# Altium schematic sheet [1] PowerSupply.SchDoc
size A4; Organization: UNMEI ELECTRICAL; Address1: 16B/12 Nguyen Du Street; Address2: Da Lat City, LD Province; SheetNumber: 1; SheetTotal: 7
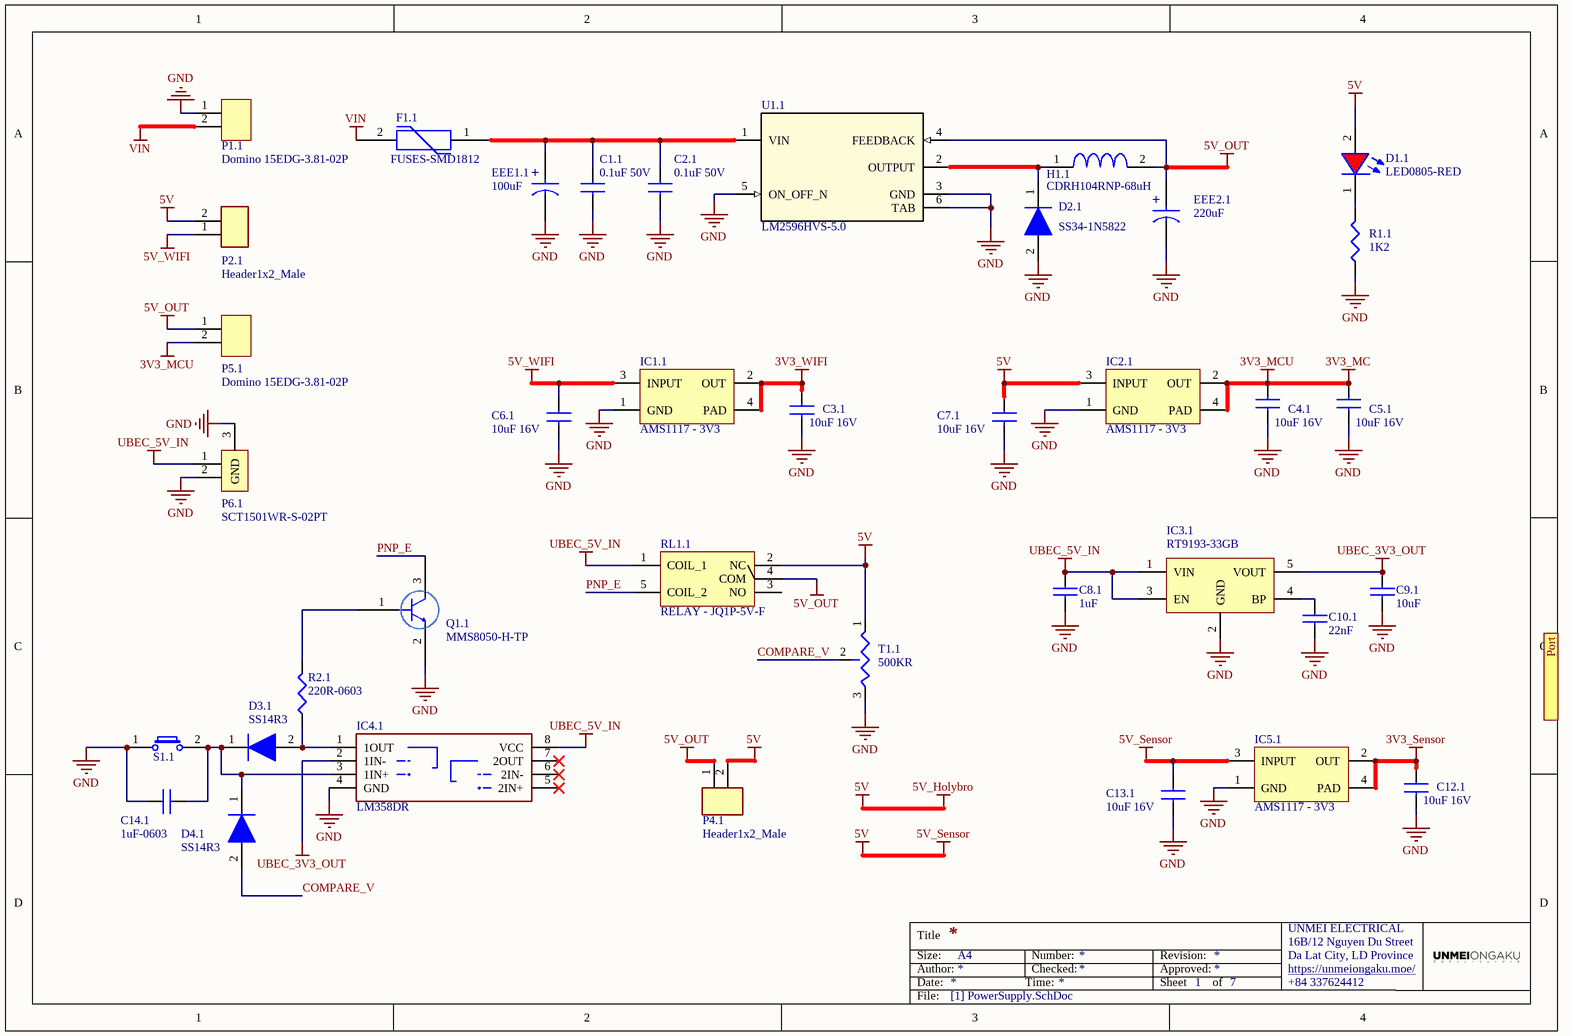
[diagram p0: [1] PowerSupply.SchDoc]

## Parts
C1.1  0.1uF 50V  [CAP0805]
C2.1  0.1uF 50V  [CAP0805]
C3.1  10uF 16V  [CAP0805]
C4.1  10uF 16V  [CAP0805]
C5.1  10uF 16V  [CAP0805]
C6.1  10uF 16V  [CAP0805]
C7.1  10uF 16V  [CAP0805]
C8.1  1uF  [CAP0603]
C9.1  10uF  [CAP0603]
C10.1  22nF  [CAP0603]
C12.1  10uF 16V  [CAP0805]
C13.1  10uF 16V  [CAP0805]
C14.1  1uF-0603  [CAP0603]
D1.1  LED0805-RED  [LED0805-RED]
D2.1  SS34-1N5822  [SS34 - 1N5822 / DO-214AA, SMA]
D3.1  SS14R3  [SS14 - 1N5819 / DO-214AA, SMA]
D4.1  SS14R3  [SS14 - 1N5819 / DO-214AA, SMA]
EEE1.1  100uF  [CAPACITOR/ALU - SIZE D8/SMD - 6.3X7.7]
EEE2.1  220uF  [CAPACITOR/ALU - SIZE D8/SMD - 6.3X7.7]
F1.1  FUSES-SMD1812  [FUSES - SMD1812]
H1.1  CDRH104RNP-68uH  [CDRH104RNP]
IC1.1  AMS1117 - 3V3  [SOT223-4M_AMS1117_3V3]
IC2.1  AMS1117 - 3V3  [SOT223-4M_AMS1117_3V3]
IC3.1  RT9193-33GB  [SOT23-5]
IC4.1  LM358DR  [SOP8]
IC5.1  AMS1117 - 3V3  [SOT223-4M_AMS1117_3V3]
P1.1  Domino 15EDG-3.81-02P  [Domino 15EDG3.81 2P]
P2.1  Header1x2_Male  [HDR1x2_2.54_MALE]
P4.1  Header1x2_Male  [HDR1x2_2.54_MALE]
P5.1  Domino 15EDG-3.81-02P  [Domino 15EDG3.81 2P]
P6.1  SCT1501WR-S-02PT  [Connector ZH1.5 2P SMD]
Q1.1  MMS8050-H-TP  [SOT23]
R1.1  1K2  [RES0805]
R2.1  220R-0603  [RES0603 - 3D]
RL1.1  RELAY - JQ1P-5V-F  [RELAY - JQ1P - XV - F 10A SPDT]
S1.1  434121043816  [Switches-6x3.5x4.3mm]  (value not drawn)
T1.1  500KR  [Rheostat - 3296W]
U1.1  LM2596HVS-5.0  [TO265-5]

## Ports
Port

## Nets
3V3_MC: C4.1.1 C5.1.1 IC2.1.2(OUT) IC2.1.4(PAD) P5.1.2  [also labelled 3V3_MCU]
3V3_Sensor: C12.1.1 IC5.1.2(OUT) IC5.1.4(PAD)
3V3_WIFI: C3.1.1 IC1.1.2(OUT) IC1.1.4(PAD)
5V: C7.1.1 C13.1.1 D1.1.2(+) IC2.1.3(INPUT) IC5.1.3(INPUT) P2.1.2 P4.1.2 RL1.1.2(NC) T1.1.1  [also labelled 5V_Holybro, 5V_Sensor]
5V_OUT: EEE2.1.1 H1.1.2 P4.1.1 P5.1.1 RL1.1.4(COM) U1.1.4(FEEDBACK)
5V_WIFI: C6.1.1 IC1.1.3(INPUT) P2.1.1
GND: C1.1.2 C2.1.2 C3.1.2 C4.1.2 C5.1.2 C6.1.2 C7.1.2 C8.1.2 C9.1.2 C10.1.2 C12.1.2 C13.1.2 C14.1.1 D2.1.2 EEE1.1.2 EEE2.1.2 IC1.1.1(GND) IC2.1.1(GND) IC3.1.2(GND) IC4.1.4(GND) IC5.1.1(GND) P1.1.1 P6.1.2 P6.1.3(GND) Q1.1.2 R1.1.1 S1.1.1 T1.1.3 U1.1.3(GND) U1.1.5(ON_OFF_N) U1.1.6(TAB)
UBEC_3V3_OUT: C9.1.1 IC3.1.5(VOUT) IC4.1.2(1IN-)
UBEC_5V_IN: C8.1.1 IC3.1.1(VIN) IC3.1.3(EN) IC4.1.8(VCC) P6.1.1 RL1.1.1(COIL_1)
VIN: F1.1.2 P1.1.2
COMPARE_V: D4.1.2 T1.1.2
PNP_E: Q1.1.3 RL1.1.5(COIL_2)
NetC1.1_1: C1.1.1 C2.1.1 EEE1.1.1 F1.1.1 U1.1.1(VIN)
NetC10.1_1: C10.1.1 IC3.1.4(BP)
NetC14.1_2: C14.1.2 D3.1.1 D4.1.1 IC4.1.3(1IN+) S1.1.2
NetD1.1_1: D1.1.1(+) R1.1.2
NetD2.1_1: D2.1.1 H1.1.1 U1.1.2(OUTPUT)
NetD3.1_2: D3.1.2 IC4.1.1(1OUT) R2.1.1
NetQ1.1_1: Q1.1.1 R2.1.2

Not connected (* = marked no-connect by the designer): IC4.1 5(2IN+)* 6(2IN-)* 7(2OUT)*; RL1.1 3(NO)

## Notes on the sheet
- Title
- Size:
- Date:
- Author:
- A4
- Time:
- Number:
- Checked:
- Revision:
- Sheet
- Approved:
- of
- https://unmeiongaku.moe/
- +84 337624412
- File:
- (in symbol EEE-1EA101XP) +

## Library data of the parts
C1.1 C2.1 = C0805C104K5RACTU: Cap Ceramic 0.1uF 50V X7R 10% SMD 2.0 x 1.2 mm 125 C Paper T/R; Manufacturer: KEMET; Capacitance: 100nF; Voltage: 500V; Supplier 1: RSComponents; Manufacturer Part Number: C0805C104K5RACTU; RoHS: Yes; Category: Ceramic Capacitors; Stock 1: 45175; Pricing 1: 25=0.20300, 100=0.18800, 250=0.17500, 500=0.16400, 1250=0.15100 (USD); Mount: Surface Mount,PCB; Case/Package: 0805; Number of Pins: 2; Dielectric Material: Ceramic; Case Code (Imperial): 0805; Case Code (Metric): 2012; Contact Plating: Tin,Matte; Min Operating Temperature: -55°C; Max Operating Temperature: 125°C; Tolerance: 10%; Packaging: Tape and Reel; Dielectric: X7R; Voltage Rating (DC): 50V; Package Quantity: 4000; Voltage Rating: 50V; Termination: SMD/SMT; Series: C0805C; Construction: Flat; Length: 2mm; Width: 1.2mm; Height: 0.9mm; Depth: 1.25mm; Lead Pitch: 0.75mm; Thickness: 0.035inch; Radiation Hardening: No; RoHS Compliant: Yes; REACH SVHC: No SVHC; ComponentLink1URL: https://datasheet.ciiva.com/32431/slceramic-chip-condensers-e-32431755.pdf?src-supplier=Distrelec; ComponentLink1Description: https://datasheet.ciiva.com/32431/slceramic-chip-condensers-e-32431755.pdf?src-supplier=Distrelec; ComponentLink2URL: https://datasheet.ciiva.com/28682/1851736-28682232.pdf?src-supplier=Element14; ComponentLink2Description: https://datasheet.ciiva.com/28682/1851736-28682232.pdf?src-supplier=Element14; ComponentLink3URL: https://datasheet.ciiva.com/18410/70095383-18410815.pdf?src-supplier=Allied+Electronics; ComponentLink3Description: https://datasheet.ciiva.com/18410/70095383-18410815.pdf?src-supplier=Allied+Electronics; ComponentLink4URL: https://datasheet.ciiva.com/14589/70095383-14589048.pdf?src-supplier=Allied+Electronics; ComponentLink4Description: https://datasheet.ciiva.com/14589/70095383-14589048.pdf?src-supplier=Allied+Electronics; Supplier Part Number 1: 2644416
C3.1 C4.1 C5.1 C6.1 C7.1 C12.1 C13.1 = C0805C106K4PACTU: Ceramic Capacitors MLCC - SMD/SMT 16V 10uF X5R 0805 10%; Manufacturer: KEMET; Dissipation Factor: 5%; Supplier 1: RSComponents; Manufacturer Part Number: C0805C106K4PACTU; RoHS: Yes; Category: Ceramic Capacitors; Stock 1: 60; Pricing 1: 10=1.00600, 50=0.94500, 100=0.88500, 250=0.82400, 500=0.75400 (USD); Mount: Surface Mount; Case/Package: 0805; Number of Pins: 2; Dielectric Material: Ceramic; Case Code (Imperial): 0805; Case Code (Metric): 2012; Contact Plating: Tin,Matte; Min Operating Temperature: -55°C; Max Operating Temperature: 85°C; Capacitance: 10uF; Tolerance: 10%; Dielectric: X5R; Voltage Rating (DC): 16V; Packaging: Tape and Reel; Voltage: 16V; Termination: SMD/SMT; Package Quantity: 1; Voltage Rating: 16V; Series: C; Construction: Flat; Length: 2mm; Width: 0.049inch; Height: 1.25mm; Depth: 1.25mm; Thickness: 0.055inch; Radiation Hardening: No; Lead Free: Lead Free; RoHS Compliant: Yes; REACH SVHC: No SVHC; ComponentLink1URL: https://datasheet.ciiva.com/7842/1732713-7842196.pdf?src-supplier=Element14; ComponentLink1Description: https://datasheet.ciiva.com/7842/1732713-7842196.pdf?src-supplier=Element14; ComponentLink2URL: https://datasheet.ciiva.com/28682/1831760-28682305.pdf?src-supplier=Element14; ComponentLink2Description: https://datasheet.ciiva.com/28682/1831760-28682305.pdf?src-supplier=Element14; ComponentLink3URL: https://datasheet.ciiva.com/11787/0900766b8116eb59-11787314.pdf?src-supplier=RSComponents; ComponentLink3Description: https://datasheet.ciiva.com/11787/0900766b8116eb59-11787314.pdf?src-supplier=RSComponents; ComponentLink4URL: https://datasheet.ciiva.com/7842/1732713-7842197.pdf?src-supplier=Element14; ComponentLink4Description: https://datasheet.ciiva.com/7842/1732713-7842197.pdf?src-supplier=Element14; ComponentLink5URL: https://datasheet.ciiva.com/26847/getdatasheetpartid-110990-26847815.pdf?src-supplier=Verical; ComponentLink5Description: https://datasheet.ciiva.com/26847/getdatasheetpartid-110990-26847815.pdf?src-supplier=Verical; Supplier Part Number 1: 6911161
C8.1 C14.1 = CC0603KRX7R7BB105: CAP CER 1UF 16V X7R 0603; Manufacturer 1: Yageo; Category 1: Capacitors; Capacitance: 1µF; Tolerance: ±10%; Supplier 1: Digi-Key; Supplier Part Number 1: 311-1446-1-ND; Manufacturer Part Number 1: CC0603KRX7R7BB105; RoHS 1: RoHS Compliant; Description 1: CAP CER 1UF 16V X7R 0603; Stock 1: 274580; Pricing 1: 1=0.1, 10=0.051, 100=0.0227, 500=0.0162, 1000=0.01274 (USD); Packaging: Cut Tape (CT); Part Status: Active; Voltage - Rated: 16V; Temperature Coefficient: X7R; Operating Temperature: -55°C ~ 125°C; Features: -; Ratings: -; Applications: General Purpose; Failure Rate: -; Mounting Type: Surface Mount, MLCC; Package / Case: 0603 (1608 Metric); Size / Dimension: 0.063" L x 0.031" W (1.60mm x 0.80mm); Height - Seated (Max): -; Thickness (Max): 0.035" (0.90mm); Lead Spacing: -; Lead Style: -; ComponentLink1URL: http://www.yageo.com/documents/recent/UPY-GPHC_X7R_6.3V-to-50V_18.pdf; ComponentLink1Description: http://www.yageo.com/documents/recent/UPY-GPHC_X7R_6.3V-to-50V_18.pdf; Value: 1uF
C9.1 = CC0603KRX5R6BB106: CAP CER 10UF 10V X5R 0603; Manufacturer 1: Yageo; Category 1: Capacitors; Capacitance: 10µF; Tolerance: ±10%; Supplier 1: Digi-Key; Supplier Part Number 1: 311-1782-1-ND; Manufacturer Part Number 1: CC0603KRX5R6BB106; RoHS 1: RoHS Compliant; Description 1: CAP CER 10UF 10V X5R 0603; Stock 1: 66566; Pricing 1: 1=0.33, 10=0.225, 100=0.1272, 500=0.08982, 1000=0.07858 (USD); Packaging: Cut Tape (CT); Part Status: Active; Voltage - Rated: 10V; Temperature Coefficient: X5R; Operating Temperature: -55°C ~ 85°C; Features: -; Ratings: -; Applications: General Purpose; Failure Rate: -; Mounting Type: Surface Mount, MLCC; Package / Case: 0603 (1608 Metric); Size / Dimension: 0.063" L x 0.031" W (1.60mm x 0.80mm); Height - Seated (Max): -; Thickness (Max): 0.035" (0.90mm); Lead Spacing: -; Lead Style: -; ComponentLink1URL: http://www.yageo.com/documents/recent/UPY-GPHC_X5R_4V-to-50V_24.pdf; ComponentLink1Description: http://www.yageo.com/documents/recent/UPY-GPHC_X5R_4V-to-50V_24.pdf; Value: 10uF
C10.1 = CC0603KRX7R9BB223: Multilayer Ceramic Capacitors MLCC - SMD/SMT 22nF 50V X7R 10%; Manufacturer: Yageo; Capacitance: 0.022 uF; Type: General Purpose and High Capacitance Surface Mount Ceramic Multilayer Capacitor; Voltage Rating DC: 50 VDC; Capacitance - pF: 22000 pF; Class: Class 2; Supplier 1: Mouser; Manufacturer Part Number: CC0603KRX7R9BB223; RoHS: RoHS Compliant; Category: Multilayer Ceramic Capacitors MLCC - SMD/SMT; Stock 1: 23033; Pricing 1: 1=0.100, 10=0.064, 100=0.020, 1000=0.015, 4000=0.011, 8000=0.010, 24000=0.009 (USD); Height: 0.8 mm; Length: 1.6 mm; Package / Case: 0603 (1608 metric); Packaging: Cut Tape; Product: General Type MLCCs; Series: CC; Termination Style: SMD/SMT; Tolerance: 10 %; Width: 0.8 mm; Brand: Yageo; Capacitance - nF: 22 nF; Case Code - in: 0603; Case Code - mm: 1608; Dielectric: X7R; Maximum Operating Temperature: + 125 C; Minimum Operating Temperature: - 55 C; Product Type: Ceramic Capacitors; Standard Pack Qty: 4000; Subcategory: Capacitors; Termination: Standard; RoHS - Mouser: Y; Minimum Order Quantity: 1; Reeling: True; ComponentLink1URL: https://www.mouser.com/datasheet/2/447/UPY-GPHC_X7R_6.3V-to-50V_18-1154002.pdf; ComponentLink1Description: https://www.mouser.com/datasheet/2/447/UPY-GPHC_X7R_6.3V-to-50V_18-1154002.pdf; Supplier Part Number 1: 603-CC603KRX7R9BB223; Value: 22nF
D2.1 = SS34: SS Series 500 mV 3 A 40 V Max Reverse Voltage Schottky Rectifier - DO-214AB; Manufacturer: ON Semiconductor / Fairchild; Number of Terminals/Pins: 2; Package Body Material: Plastic; Diode Element Material: SILICON; Forward Current: 3A; Element Configuration: Single; Max Repetitive Reverse Voltage (Vrrm): 40V; Forward Voltage: 500mV; Max Forward Surge Current (Ifsm): 100A; Polarity: Standard; Max Reverse Current: 500uA; Number of Elements: 1; Max Power Dissipation: 2.27W; Supplier 1: Newark; Manufacturer Part Number: SS34; RoHS: Yes; Category: Schottky Diodes; Stock 1: 7040; Pricing 1: 1=0.65000, 25=0.57600, 50=0.50900, 100=0.44100, 250=0.39500, 500=0.34900, 1000=0.27900 (USD); Mount: Surface Mount; Case/Package: SMC; Number of Pins: 2; Contact Plating: Tin,Matte; Package Shape: Rectangular; Terminal Finish: Tin; Min Operating Temperature: -55°C; Max Operating Temperature: 150°C; Packaging: Tape and Reel; Voltage Rating (DC): 40V; Current Rating: 3A; Output Current: 3A; Max Surge Current: 100A; Package Quantity: 1; Max Reverse Leakage Current: 500uA; Peak Non-Repetitive Surge Current: 100A; Current: 3A; Voltage: 40V; Average Rectified Current: 3A; Max Reverse Voltage (DC): 40V; Series: -; Moisture Sensitivity Level: 1; JESD-30 Code: R-PDSO-C2; Peak Reflow Temperature (Cel): 260°C; Surface Mount: Yes; Terminal Position: DUAL; Technology: SCHOTTKY; Number of Phases: 1; Terminal Form: C BEND; Length: 7.15mm; Width: 6.25mm; Height: 2.75mm; Radiation Hardening: No; RoHS Compliant: Yes; Reach SVHC Compliant: Yes; Lead Free: Lead Free; JEDEC-95 Code: DO-214AB; Supplier Part Number 1: 18C8659
D3.1 D4.1 = SS14R3: 1A, 40V, Schottky Rectifier; Manufacturer: Taiwan Semiconductor; Supplier 1: Mouser; Manufacturer Part Number: SS14R3; RoHS: Yes; Category: Uncategorized; Stock 1: 5400; Pricing 1: 3600=0.07700, 9000=0.06800, 10000=0.06800, 23400=0.06400, 48600=0.05800 (USD); Case/Package: SMA; Number of Pins: 2; ComponentLink1URL: http://components.arrow.com/part/dataview/0323_01151906?src-supplier=Arrow+Europe; ComponentLink1Description: http://components.arrow.com/part/dataview/0323_01151906?src-supplier=Arrow+Europe; Supplier Part Number 1: 821-SS14R3
EEE1.1 EEE2.1 = EEE-1EA101XP: Cap Aluminum 100uF 25V 20% (6.3 X 7.7mm) SMD 143mA 2000h 85°C T/R; Manufacturer: Panasonic; Polarity: Polar; Life (Hours): 2000Hour; Leakage Current: 3uA; Supplier 1: Digi-Key; Manufacturer Part Number: EEE-1EA101XP; RoHS: Yes; Category: Aluminum Electrolytic Capacitors; Pricing 1: 1=0.52000, 10=0.36100, 50=0.25240, 100=0.21630 (USD); Mount: Surface Mount,PCB; Case/Package: Radial; Contact Plating: Tin; Min Operating Temperature: -40°C; Max Operating Temperature: 85°C; Capacitance: 100uF; Tolerance: 20%; Voltage Rating (DC): 25V; Ripple Current: 143mA; Packaging: Tape and Reel; Voltage Rating: 25V; Package Quantity: 900; Termination: SMD/SMT; Ripple Current (AC): 143mA; Voltage: 25V; Series: S; Construction: Cylindrical; Diameter: 6.3mm; Length: 8mm; Height: 7.7mm; Height - Seated (Max): 0.303inch; Radiation Hardening: No; Lead Free: Lead Free; RoHS Compliant: Yes; REACH SVHC: Unknown; ComponentLink1URL: https://datasheet.ciiva.com/24022/aba0000ce2-40801-24022875.pdf?src-supplier=Mouser; ComponentLink1Description: https://datasheet.ciiva.com/24022/aba0000ce2-40801-24022875.pdf?src-supplier=Mouser; ComponentLink2URL: https://datasheet.ciiva.com/16201/aba0000ce2-16201065.pdf?src-supplier=Future+Electronics; ComponentLink2Description: https://datasheet.ciiva.com/16201/aba0000ce2-16201065.pdf?src-supplier=Future+Electronics; ComponentLink3URL: https://datasheet.ciiva.com/30108/11aba0000ce2-30108047.pdf?src-supplier=Onlinecomponents.com; ComponentLink3Description: https://datasheet.ciiva.com/30108/11aba0000ce2-30108047.pdf?src-supplier=Onlinecomponents.com; ComponentLink4URL: https://datasheet.ciiva.com/17529/aba0000ce2-17529557.pdf?src-supplier=Avnet+Europe; ComponentLink4Description: https://datasheet.ciiva.com/17529/aba0000ce2-17529557.pdf?src-supplier=Avnet+Europe; Supplier Part Number 1: PCE3898CT-ND
H1.1 = CDRH104RNP-680NC: Ind Power Shielded Wirewound 68uH 30% 100KHz Ferrite 1.42A Carrier T/R; Manufacturer: Sumida; Saturation Current: 1.5A; DC Resistance (DCR): 213mR; Supplier 1: Digi-Key; Manufacturer Part Number: CDRH104RNP-680NC; RoHS: Yes; Category: Fixed Inductors; Stock 1: 26557; Pricing 1: 1=1.78000, 10=1.64700, 25=1.51000, 50=1.29060, 100=1.15320, 250=0.98848, 500=0.93356 (USD); Mount: Surface Mount; Case/Package: Nonstandard; Core Material: Ferrite; Min Operating Temperature: -40°C; Max Operating Temperature: 100°C; Package Quantity: 1000; Current Rating: 1.42A; Tolerance: 30%; Shielding: Shielded; Packaging: Tape and Reel; Inductance: 68uH; Test Frequency: 100kHz; Max DC Current: 1.42A; Termination: SMD/SMT; Series: CDRH; Rated Current-Max: 1.5A; Length: 0.402inch; Width: 0.405inch; Height: 4mm; Height - Seated (Max): 0.157inch; Depth: 10.3mm; Radiation Hardening: No; Lead Free: Lead Free; RoHS Compliant: Yes; ComponentLink1URL: http://www.sumida.com/products/pdf/CDRH104,104R.pdf?src-supplier=Digi-Key; ComponentLink1Description: http://www.sumida.com/products/pdf/CDRH104,104R.pdf?src-supplier=Digi-Key; ComponentLink2URL: http://products.sumida.com/products/pdf/CDRH104R.pdf?src-supplier=Digi-Key; ComponentLink2Description: http://products.sumida.com/products/pdf/CDRH104R.pdf?src-supplier=Digi-Key; ComponentLink3URL: http://www.sumida.com/products/pdf/CDRH104,104R.pdf?src-supplier=Mouser; ComponentLink3Description: http://www.sumida.com/products/pdf/CDRH104,104R.pdf?src-supplier=Mouser; ComponentLink4URL: http://www.sumida.com/products/pdf/CDRH104R.pdf?src-supplier=Avnet; ComponentLink4Description: http://www.sumida.com/products/pdf/CDRH104R.pdf?src-supplier=Avnet; ComponentLink5URL: http://www.sumida.com/products/pdf/CDRH104,104R.pdf?src-supplier=Future+Electronics; ComponentLink5Description: http://www.sumida.com/products/pdf/CDRH104,104R.pdf?src-supplier=Future+Electronics; Supplier Part Number 1: 308-2170-1-ND
IC1.1 IC2.1 IC5.1 = AMS1117 - 3V3: LDO Voltage Regulators 3.3V 1A Positive; Manufacturer: ON Semiconductor; Manufacturer Part Number: NCP1117ST33T3G; Input Voltage MAX: 20 V; Number of Outputs: 1 Output; Output Type: Fixed; Quiescent Current: 10 mA; Dropout Voltage - Max: 1.1 V at 100 mA; Voltage Regulation Accuracy: 1 %; Dropout Voltage: 0.95 V at 100 mA; Ib - Input Bias Current: 6 mA; Line Regulation: 0.8 mV; Load Regulation: 4.3 mV; Supplier 1: Mouser; RoHS: RoHS Compliant; Category: LDO Voltage Regulators; Stock 1: 0; Pricing 1: 1=0.450, 10=0.366, 100=0.223, 1000=0.173, 4000=0.147, 8000=0.137, 24000=0.130, 48000=0.127 (USD); Height: 1.69 mm (Max); Length: 6.7 mm (Max); Output Current: 1 A; Output Voltage: 3.3 V; Package / Case: SOT-223-3; Packaging: Cut Tape; Series: NCP1117; Width: 3.7 mm (Max); Brand: ON Semiconductor; Mounting Style: SMD/SMT; Maximum Operating Temperature: + 125 C; Minimum Operating Temperature: 0 C; Polarity: Positive; Standard Pack Qty: 4000; RoHS - Mouser: Y; Minimum Order Quantity: 1; Reeling: True; ComponentLink1URL: https://www.mouser.com/ds/2/308/NCP1117-D-81326.pdf; ComponentLink1Description: https://www.mouser.com/ds/2/308/NCP1117-D-81326.pdf; Supplier Part Number 1: 863-NCP1117ST33T3G
IC3.1 = RT9193-33GB: IC REG LDO 3.3V 0.3A SOT23-5
IC4.1 = LM358DR: IC OPAMP GP 700KHZ 8SOIC; Manufacturer: Texas Instruments; Slew Rate: 0.3V/µs; Common Mode Rejection Ratio: 65dB; Max Supply Voltage: 32V; Min Supply Voltage: 3V; Min Dual Supply Voltage: 1.5V; Max Dual Supply Voltage: 16V; Number of Channels: 2; Output Current: 30mA; Nominal Supply Current: 1.2mA; Voltage Gain: 100dB; Input Bias Current: 250nA; Input Offset Voltage (Vos): 7mV; Operating Supply Current: 1mA; Amplifier Type: GENERAL PURPOSE; Dual Supply Voltage: 9V; Supplier 1: Arrow Electronics; Manufacturer Part Number: LM358DR; RoHS: Yes; Category: Amplifiers - Op Amps, Buffer, Instrumentation; Stock 1: 1847; Pricing 1: 1=0.39310, 10=0.31690, 25=0.28850, 100=0.21440, 250=0.19280, 500=0.19100, 1000=0.15350 (USD); Mount: Surface Mount; Case/Package: SOIC; Number of Pins: 8; Contact Plating: Gold; Min Operating Temperature: 0°C; Max Operating Temperature: 70°C; Package Quantity: 2500; Packaging: Tape and Reel; Operating Supply Voltage: 16V; Number of Circuits: 2; Gain Bandwidth Product: 700kHz; Output Current per Channel: 30mA; Number of Elements: 2; Series: -; Supply Current: 1.2mA; Technology: BIPOLAR; Number of Amplifiers: 2; Bandwidth: 700kHz; Power Supply Rejection Ratio (PSRR): 65dB; Unity Gain Bandwidth Product: 700kHz; Length: 4.9mm; Width: 3.91mm; Height: 1.58mm; Radiation Hardening: No; Lead Free: Lead Free; RoHS Compliant: Yes; Reach SVHC Compliant: Yes; ComponentLink1URL: https://datasheet.ciiva.com/1795/lm358-1795488.pdf?src-supplier=Digi-Key; ComponentLink1Description: https://datasheet.ciiva.com/1795/lm358-1795488.pdf?src-supplier=Digi-Key; ComponentLink2URL: https://datasheet.ciiva.com/27056/2016330-27056228.pdf?src-supplier=Jameco; ComponentLink2Description: https://datasheet.ciiva.com/27056/2016330-27056228.pdf?src-supplier=Jameco; ComponentLink3URL: https://datasheet.ciiva.com/7709/1874566-7709823.pdf?src-supplier=Element14; ComponentLink3Description: https://datasheet.ciiva.com/7709/1874566-7709823.pdf?src-supplier=Element14; ComponentLink4URL: https://datasheet.ciiva.com/46385/1874566-46385851.pdf?src-supplier=Element14; ComponentLink4Description: https://datasheet.ciiva.com/46385/1874566-46385851.pdf?src-supplier=Element14; ComponentLink5URL: https://datasheet.ciiva.com/46390/1874566-46390414.pdf?src-supplier=Element14; ComponentLink5Description: https://datasheet.ciiva.com/46390/1874566-46390414.pdf?src-supplier=Element14; ComponentLink6URL: https://datasheet.ciiva.com/1795/lm358-1795487.pdf?src-supplier=Digi-Key; ComponentLink6Description: https://datasheet.ciiva.com/1795/lm358-1795487.pdf?src-supplier=Digi-Key; ComponentLink7URL: https://datasheet.ciiva.com/1795/lm358-1795489.pdf?src-supplier=Digi-Key; ComponentLink7Description: https://datasheet.ciiva.com/1795/lm358-1795489.pdf?src-supplier=Digi-Key; ComponentLink8URL: https://datasheet.ciiva.com/2973/lm358a-2973386.pdf?src-supplier=Avnet; ComponentLink8Description: https://datasheet.ciiva.com/2973/lm358a-2973386.pdf?src-supplier=Avnet; Supplier Part Number 1: LM358DR
P2.1 P4.1 = HDR1x2_2.54_MALE: Header1x2_2.54_MALE
Q1.1 = MMS8050-H-TP: Trans Gp Bjt NPN 25V 0.5A 3-PIN SOT-23 T/r; Manufacturer: MCC; Max Collector Current: 500mA; Collector Emitter Voltage (VCEO): 600mV; Max Power Dissipation: 300mW; Transition Frequency: 150MHz; Supplier 1: Mouser; Manufacturer Part Number: MMS8050-H-TP; RoHS: Yes; Category: Uncategorized; Stock 1: 417; Pricing 1: 1=0.21000, 10=0.17100, 50=0.17100, 100=0.09100, 1000=0.04100, 10000=0.02700 (USD); Mount: Surface Mount; Case/Package: TO-236-3; Number of Pins: 3; Min Operating Temperature: -55°C; Max Operating Temperature: 150°C; Packaging: Tape and Reel; Collector Emitter Breakdown Voltage: 25V; RoHS Compliant: Yes; ComponentLink1URL: http://components.arrow.com/part/dataview/56206496S302966N2022?src-supplier=Arrow+Electronics; ComponentLink1Description: http://components.arrow.com/part/dataview/56206496S302966N2022?src-supplier=Arrow+Electronics; ComponentLink2URL: http://www.mccsemi.com/up_pdf/MMS8050(SOT-23).pdf?src-supplier=Digi-Key; ComponentLink2Description: http://www.mccsemi.com/up_pdf/MMS8050(SOT-23).pdf?src-supplier=Digi-Key; Supplier Part Number 1: 833-MMS8050-H-TP
R1.1 = RC0805JR-071K5L: 贴片电阻 1.5KΩ ±5% 1/8W ±100ppm/℃ 0805; Manufacturer: Yageo; Resistance: 1.5kR; Temperature Coefficient: 100ppm/°C; Power Rating: 125mW; Voltage Rating: 150V; Supplier 1: Newark; Manufacturer Part Number: RC0805JR-071K5L; RoHS: Yes; Category: Chip SMD Resistors; Stock 1: 2129; Pricing 1: 1=0.12000, 25=0.06000, 50=0.03800, 100=0.02700, 250=0.02100, 500=0.01600, 1000=0.01100, 2500=0.00900 (USD); Case/Package: 0805; Contact Plating: Tin,Matte,Lead; Case Code (Imperial): 0805; Case Code (Metric): 2012; Size Code: 0805; Min Operating Temperature: -55°C; Max Operating Temperature: 155°C; Tolerance: 5%; Resistor Type: Thick Film; Packaging: Tape and Reel; Package Quantity: 1; Termination: SMD/SMT; Number of Terminations: 2; Max Power Dissipation: 125mW; Features: Moisture Resistant; Series: RC; Resistance Tolerance: 5%; Construction: Rectangular; Length: 0.079inch; Width: 0.049inch; Height: 0.024inch; Depth: 1.25mm; Radiation Hardening: No; REACH SVHC: Unknown; Military Standard: Not; Lead Free: Lead Free; RoHS Compliant: Yes; ComponentLink1URL: https://datasheet.ciiva.com/46395/444164-46395130.pdf?src-supplier=Element14; ComponentLink1Description: https://datasheet.ciiva.com/46395/444164-46395130.pdf?src-supplier=Element14; ComponentLink2URL: https://datasheet.ciiva.com/2456/pyu-r-int-thick-7-2456074.pdf?src-supplier=Digi-Key; ComponentLink2Description: https://datasheet.ciiva.com/2456/pyu-r-int-thick-7-2456074.pdf?src-supplier=Digi-Key; ComponentLink3URL: https://datasheet.ciiva.com/2456/pyu-r-int-thick-7-2456075.pdf?src-supplier=Digi-Key; ComponentLink3Description: https://datasheet.ciiva.com/2456/pyu-r-int-thick-7-2456075.pdf?src-supplier=Digi-Key; ComponentLink4URL: https://datasheet.ciiva.com/2456/pyu-r-int-thick-7-2456073.pdf?src-supplier=Digi-Key; ComponentLink4Description: https://datasheet.ciiva.com/2456/pyu-r-int-thick-7-2456073.pdf?src-supplier=Digi-Key; ComponentLink5URL: https://datasheet.ciiva.com/17026/rc0805-17026842.pdf?src-supplier=Future+Electronics; ComponentLink5Description: https://datasheet.ciiva.com/17026/rc0805-17026842.pdf?src-supplier=Future+Electronics; Supplier Part Number 1: 68R0255
R2.1 = RC0603JR-07220RL: RES SMD 220 OHM 5% 1/10W 0603; Manufacturer 1: Yageo; Category 1: Resistors; Resistance (Ohms): 220; Power (Watts): 0.1W, 1/10W; Temperature Coefficient: ±100ppm/°C; Value: 220R; Supplier 1: Digi-Key; Supplier Part Number 1: 311-220GRCT-ND; Manufacturer Part Number 1: RC0603JR-07220RL; RoHS 1: RoHS Compliant; Description 1: RES SMD 220 OHM 5% 1/10W 0603; Stock 1: 1346821; Pricing 1: 1=0.1, 10=0.011, 100=0.0044, 1000=0.00198, 2500=0.00172 (USD); Packaging: Cut Tape (CT); Part Status: Active; Tolerance: ±5%; Composition: Thick Film; Features: Moisture Resistant; Operating Temperature: -55°C ~ 155°C; Package / Case: 0603 (1608 Metric); Supplier Device Package: 0603; Size / Dimension: 0.063" L x 0.031" W (1.60mm x 0.80mm); Height - Seated (Max): 0.022" (0.55mm); Failure Rate: -; ComponentLink1URL: http://www.yageo.com/documents/recent/PYu-RC_Group_51_RoHS_L_7.pdf; ComponentLink1Description: http://www.yageo.com/documents/recent/PYu-RC_Group_51_RoHS_L_7.pdf
RL1.1 = RELAY - JQ1P-5V-F: RELAY GEN PURPOSE SPDT 10A 5V; Manufacturer: Panasonic; Max Voltage Rating (AC): 250V; Max Voltage Rating (DC): 110V; Power Consumption: 400mW; Coil Current: 80mA; Operate Time: 20ms; Release Time: 10ms; Coil Resistance: 62.5R; Relay Type: General Purpose; Coil Type: Non-Latching; Supplier 1: Farnell; Manufacturer Part Number: JQ1P-5V-F; RoHS: Yes; Category: Signal Relays; Pricing 1: 1=2.43000, 10=2.26000, 25=2.01000, 50=1.92000, 100=1.84000 (GBP); Mount: Through Hole; Number of Pins: 5; Contact Material: Tin,Silver; Weight: 7g; Min Operating Temperature: -40°C; Max Operating Temperature: 70°C; Package Quantity: 100; Packaging: Bulk; Contact Current Rating: 10A; Throw Configuration: SPDT; Termination: PC Pin; Coil Power: 400mW; Coil Voltage (DC): 5V; Series: JQ; Voltage Rating (AC): 250V; Power Rating: 400mW; Length: 20mm; Width: 20mm; Height: 15.6mm; Depth: 10mm; Lead Free: Lead Free; RoHS Compliant: Yes; ComponentLink1URL: https://datasheet.ciiva.com/30096/mech-eng-jq-30096783.pdf?src-supplier=Onlinecomponents.com; ComponentLink1Description: https://datasheet.ciiva.com/30096/mech-eng-jq-30096783.pdf?src-supplier=Onlinecomponents.com; ComponentLink2URL: https://datasheet.ciiva.com/8000/1643500-8000170.pdf?src-supplier=Element14; ComponentLink2Description: https://datasheet.ciiva.com/8000/1643500-8000170.pdf?src-supplier=Element14; Supplier Part Number 1: 2095667
S1.1 = 434121043816: Switch Tactile Spst-no 0.05A 12V; Manufacturer: Wurth Electronics; Mechanical Life: 50000Cycles; Actuator Material: Polymer,Liquid Crystal Polymer; Contact Current Rating: 50mA; Operating Force: 160gf; Illumination Type: Non-Illuminated,Illuminated; Throw Configuration: SPST; Insulation Resistance: 100MR; Switch Travel: 0.25mm; Switch Function: Off-Mom; Actuator Length: 0.8mm; Supplier 1: RSComponents; Manufacturer Part Number: 434121043816; RoHS: Yes; Category: Tactile Switches; Stock 1: 337; Pricing 1: 1=1.69500 (USD); Mount: Surface Mount; Contact Material: Stainless Steel,Steel; Min Operating Temperature: -40°C; Max Operating Temperature: 85°C; Current Rating: 50mA; Packaging: Tape and Reel; Termination: SMD/SMT; Series: WS-TASV; Contact Type: 1 maker; Length: 8mm; Width: 3.5mm; Height: 4.3mm; REACH SVHC: No SVHC; RoHS Compliant: Yes; ComponentLink1URL: https://datasheet.ciiva.com/30466/0900766b8126b631-30466746.pdf?src-supplier=RSComponents; ComponentLink1Description: https://datasheet.ciiva.com/30466/0900766b8126b631-30466746.pdf?src-supplier=RSComponents; ComponentLink2URL: https://datasheet.ciiva.com/29123/711754-da-01-en-taster-434121043816-29123819.pdf?src-supplier=Conrad; ComponentLink2Description: https://datasheet.ciiva.com/29123/711754-da-01-en-taster-434121043816-29123819.pdf?src-supplier=Conrad; ComponentLink3URL: https://datasheet.ciiva.com/1532/434121043816-1532524.pdf?src-supplier=Element14; ComponentLink3Description: https://datasheet.ciiva.com/1532/434121043816-1532524.pdf?src-supplier=Element14; ComponentLink4URL: https://datasheet.ciiva.com/1633/434121043816-1633934.pdf?src-supplier=Farnell; ComponentLink4Description: https://datasheet.ciiva.com/1633/434121043816-1633934.pdf?src-supplier=Farnell; Supplier Part Number 1: 7856421
T1.1 = 3296W-1-504LF: Res Cermet Trimmer 500K Ohm 10% 1/2W 25(Elec)Turn 2.19mm (9.53 X 4.83 X 11.55mm) Pin Thru-Hole Tube; Manufacturer: Bourns; Color: Blue; Power Rating: 500mW; Number of Turns: 25; Temperature Coefficient: 100ppm/°C; Supplier 1: Newark; Manufacturer Part Number: 3296W-1-504LF; RoHS: Yes; Category: Variable Resistors and Potentiometers; Stock 1: 95; Pricing 1: 1=2.43000, 10=1.85000, 25=1.82000, 50=1.79000, 100=1.76000, 500=1.39000 (USD); Mount: Through Hole,Panel,PCB; Weight: 0.03oz; Contact Plating: Tin,Matte; Min Operating Temperature: -55°C; Max Operating Temperature: 125°C; Tolerance: 10%; Resistance: 500kR; Packaging: Rail/Tube; Package Quantity: 50; Resistor Type: Cermet; Termination: Pin; Taper: Linear; Max Power Dissipation: 500mW; Series: 3296; Resistance Tolerance: 10%; Technology: CERMET; Length: 9.53mm; Width: 9.53mm; Height: 11.55mm; Depth: 4.83mm; Radiation Hardening: No; Reach SVHC Compliant: Yes; Military Standard: Not; Lead Free: Lead Free; RoHS Compliant: Yes; ComponentLink1URL: https://datasheet.ciiva.com/11832/0900766b8069ccf4-11832237.pdf?src-supplier=RSComponents; ComponentLink1Description: https://datasheet.ciiva.com/11832/0900766b8069ccf4-11832237.pdf?src-supplier=RSComponents; ComponentLink2URL: https://datasheet.ciiva.com/19466/853812-19466623.pdf?src-supplier=Jameco; ComponentLink2Description: https://datasheet.ciiva.com/19466/853812-19466623.pdf?src-supplier=Jameco; ComponentLink3URL: https://datasheet.ciiva.com/29122/447286-da-01-en-trimmer-tht-3296w-1-504lf-500k-0-5w-29122370.pdf?src-supplier=Conrad; ComponentLink3Description: https://datasheet.ciiva.com/29122/447286-da-01-en-trimmer-tht-3296w-1-504lf-500k-0-5w-29122370.pdf?src-supplier=Conrad; ComponentLink4URL: https://datasheet.ciiva.com/3266/3296-3266198.pdf?src-supplier=Avnet; ComponentLink4Description: https://datasheet.ciiva.com/3266/3296-3266198.pdf?src-supplier=Avnet; ComponentLink5URL: https://datasheet.ciiva.com/15156/getdatasheetpartid-27989-15156235.pdf?src-supplier=Verical; ComponentLink5Description: https://datasheet.ciiva.com/15156/getdatasheetpartid-27989-15156235.pdf?src-supplier=Verical; ComponentLink6URL: https://datasheet.ciiva.com/2156/3296-2156894.pdf?src-supplier=Digi-Key; ComponentLink6Description: https://datasheet.ciiva.com/2156/3296-2156894.pdf?src-supplier=Digi-Key; ComponentLink7URL: https://datasheet.ciiva.com/30196/3296-30196060.pdf?src-supplier=Onlinecomponents.com; ComponentLink7Description: https://datasheet.ciiva.com/30196/3296-30196060.pdf?src-supplier=Onlinecomponents.com; ComponentLink8URL: https://datasheet.ciiva.com/16715/70153578-16715020.pdf?src-supplier=Allied+Electronics; ComponentLink8Description: https://datasheet.ciiva.com/16715/70153578-16715020.pdf?src-supplier=Allied+Electronics; ComponentLink9URL: https://datasheet.ciiva.com/1131/1815117-1131347.pdf?src-supplier=Element14; ComponentLink9Description: https://datasheet.ciiva.com/1131/1815117-1131347.pdf?src-supplier=Element14; Supplier Part Number 1: 62J1477
U1.1 = LM2596S-ADJ/NOPB: Optoisolator 5KV Trans 4SMD / Optocoupler Dc-in 1-CH Transistor Dc-out 4-PIN PDIP SMD; Mfr_Name: Texas Instruments; PartNumber: LM2596SX-ADJ/NOPB; Manufacturer Part Number: PC817XNNIP0F; CompType: IC; Reverse Breakdown Voltage: 6V; Forward Voltage: 1.4V; Forward Current: 50mA; Rise Time: 18000ns; Collector Emitter Voltage (VCEO): 80V; Collector Emitter Saturation Voltage: 200mV; Number of Elements: 1; Power Dissipation: 200mW; Input Type: DC; Output Current per Channel: 30mA; Type: DEV; RefDes: RefDes; Copyright: Copyright (C) 2021 Ultra Librarian. All rights reserved.; Manufacturer_Part_Number: LM2596S-ADJ/NOPB; Alternate_PartNumber: LM2596S-ADJ/NOPB; PackageReference: KTT0005B; MountType: SMT; RoHS: Y; Manufacturer: Texas Instruments; Supplier 1: Farnell; Category: Optocouplers; Pricing 1: 1=0.31700, 25=0.29900, 100=0.21300, 250=0.17700, 500=0.14100, 2000=0.13800 (GBP); Mount: Surface Mount; Case/Package: SMD/SMT; Number of Pins: 4; Contact Plating: Copper,Tin; Min Operating Temperature: -30°C; Max Operating Temperature: 100°C; Fall Time: 18000ns; Packaging: Tape and Reel; Max Power Dissipation: 200mW; Package Quantity: 2000; Number of Channels: 1; Output Voltage: 80V; Max Input Current: 50mA; Max Collector Current: 50mA; Isolation Voltage: 5kV; Input Current: 50mA; Collector-emitter Voltage-Max: 200mV; Max Output Voltage: 80V; Isolation Voltage-Max: 5kV; Radiation Hardening: No; RoHS Compliant: Yes; Lead Free: Lead Free; ComponentLink1URL: https://datasheet.ciiva.com/15119/getdatasheetpartid-299374-15119023.pdf?src-supplier=Verical; ComponentLink1Description: https://datasheet.ciiva.com/15119/getdatasheetpartid-299374-15119023.pdf?src-supplier=Verical; ComponentLink2URL: https://datasheet.ciiva.com/2086/pc817xxnip0f-series-2086508.pdf?src-supplier=Digi-Key; ComponentLink2Description: https://datasheet.ciiva.com/2086/pc817xxnip0f-series-2086508.pdf?src-supplier=Digi-Key; ComponentLink3URL: https://datasheet.ciiva.com/2086/pc817xxnip0f-series-2086507.pdf?src-supplier=Digi-Key; ComponentLink3Description: https://datasheet.ciiva.com/2086/pc817xxnip0f-series-2086507.pdf?src-supplier=Digi-Key; ComponentLink4URL: https://datasheet.ciiva.com/2086/pc817xxnip0f-series-2086509.pdf?src-supplier=Digi-Key; ComponentLink4Description: https://datasheet.ciiva.com/2086/pc817xxnip0f-series-2086509.pdf?src-supplier=Digi-Key; ComponentLink5URL: https://datasheet.ciiva.com/46396/1812378-46396954.pdf?src-supplier=Element14; ComponentLink5Description: https://datasheet.ciiva.com/46396/1812378-46396954.pdf?src-supplier=Element14; ComponentLink6URL: https://datasheet.ciiva.com/46435/1812378-46435723.pdf?src-supplier=Element14; ComponentLink6Description: https://datasheet.ciiva.com/46435/1812378-46435723.pdf?src-supplier=Element14; ComponentLink7URL: https://datasheet.ciiva.com/16475/pc817xnnip0f-16475911.pdf?src-supplier=Future+Electronics; ComponentLink7Description: https://datasheet.ciiva.com/16475/pc817xnnip0f-16475911.pdf?src-supplier=Future+Electronics; Supplier Part Number 1: 2420057